# Altium project PowerBoard.PrjPCB (part 2 of 3)

## Sheet PhaseCLeg.SchDoc: Phase C
size A4; DrawnBy: Jarod Krane; Organization: Altium Limited; Address1: L3, 12a Rodborough Rd; Address2: Frenchs Forest; Address3: NSW; Address4: Australia 2086; Revision: 0; SheetNumber: 6; SheetTotal: 11
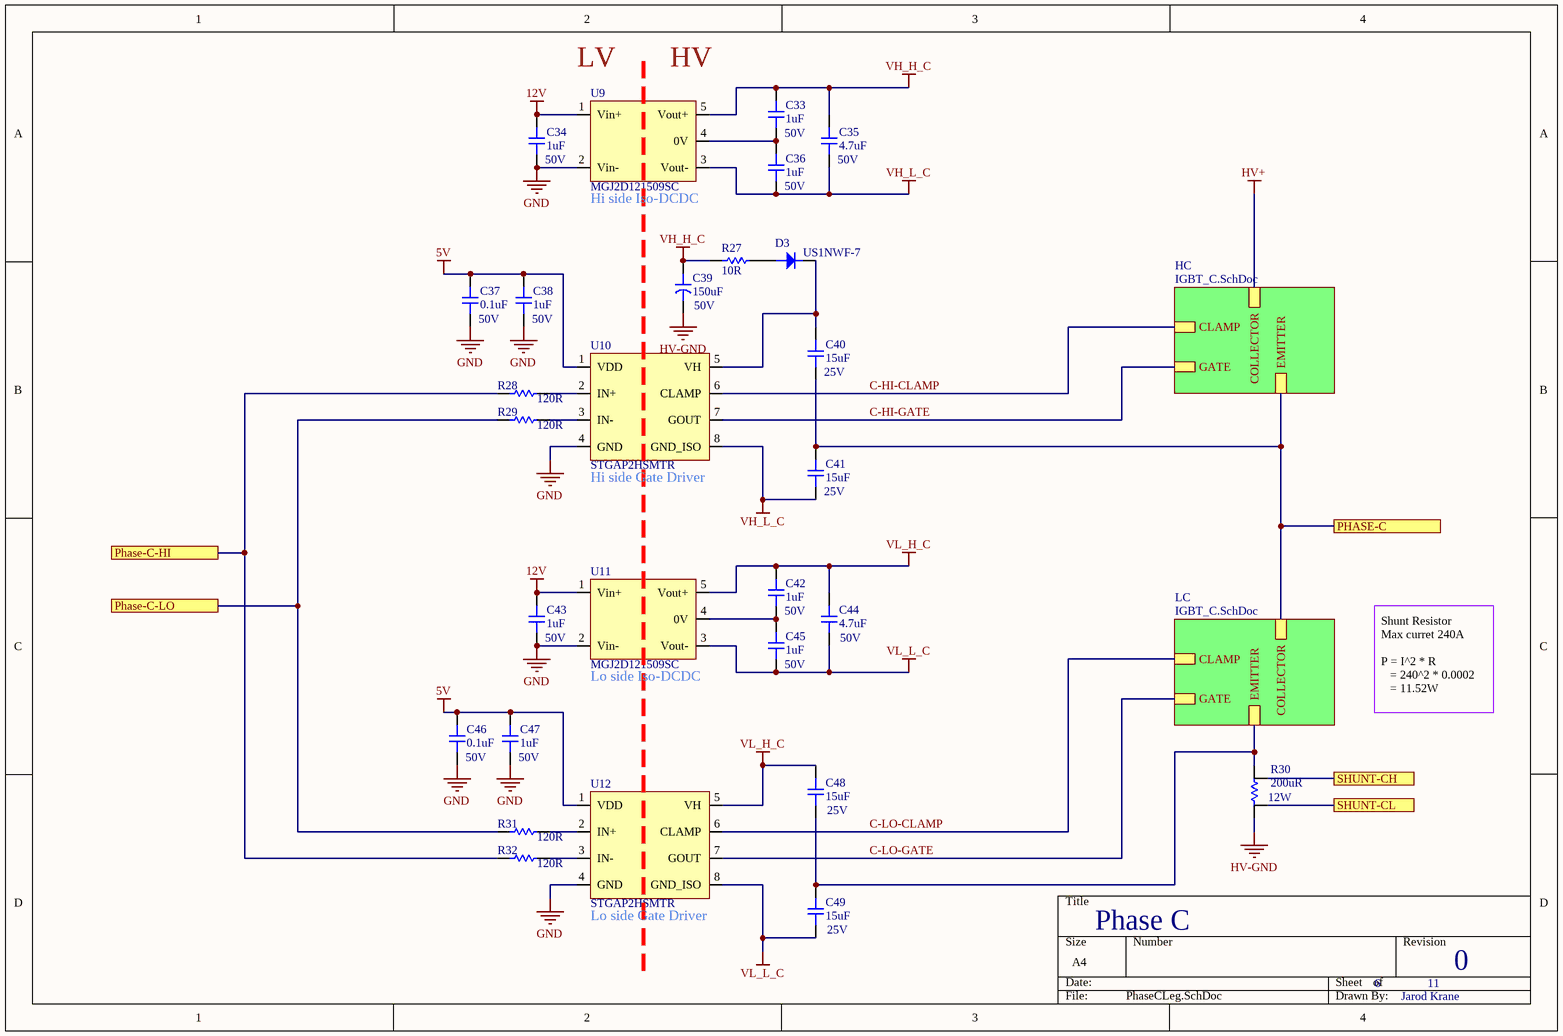
[diagram p5: PhaseCLeg.SchDoc]

### Parts
C33  1uF  Voltage Rating: 50V  [CAP-0805]
C34  1uF  Voltage Rating: 50V  [CAP-0805]
C35  4.7uF  Voltage Rating: 50V  [CAP-1206]
C36  1uF  Voltage Rating: 50V  [CAP-0805]
C37  0.1uF  Voltage: 50V  [CAP-0805]
C38  1uF  Voltage Rating: 50V  [CAP-0805]
C39  150uF  Voltage: 50V  [CAPCAN-10mm]
C40  15uF  Voltage: 25V  [CAP-1812]
C41  15uF  Voltage: 25V  [CAP-1812]
C42  1uF  Voltage Rating: 50V  [CAP-0805]
C43  1uF  Voltage Rating: 50V  [CAP-0805]
C44  4.7uF  Voltage Rating: 50V  [CAP-1206]
C45  1uF  Voltage Rating: 50V  [CAP-0805]
C46  0.1uF  Voltage: 50V  [CAP-0805]
C47  1uF  Voltage Rating: 50V  [CAP-0805]
C48  15uF  Voltage: 25V  [CAP-1812]
C49  15uF  Voltage: 25V  [CAP-1812]
D3  US1NWF-7  [DIOM2718X12N]
R27  10R  [RES-0603]
R28  120R  [RES-0603]
R29  120R  [RES-0603]
R30  200uR  Power: 12W  [RES-SHUNT]
R31  120R  [RES-0603]
R32  120R  [RES-0603]
U9  MGJ2D121509SC  [MGJ2]
U10  STGAP2HSMTR  [SO-8W]
U11  MGJ2D121509SC  [MGJ2]
U12  STGAP2HSMTR  [SO-8W]

### Sub-sheets
HC = IGBT_C.SchDoc: COLLECTOR, EMITTER, GATE, CLAMP
LC = IGBT_C.SchDoc: COLLECTOR, EMITTER, GATE, CLAMP

### Ports
PHASE-C, Phase-C-HI, Phase-C-LO, SHUNT-CH, SHUNT-CL

### Nets
5V: C37.2 C38.2 C46.2 C47.2 U10.1(VDD) U12.1(VDD)
12V: C34.2 C43.2 U9.1(Vin+) U11.1(Vin+)
GND: C34.1 C37.1 C38.1 C43.1 C46.1 C47.1 U9.2(Vin-) U10.4(GND) U11.2(Vin-) U12.4(GND)
HV-GND: C39.2 R30.1
VH_H_C: C33.2 C35.2 C39.1 R27.1 U9.5(Vout+)
VH_L_C: C35.1 C36.1 C41.1 U9.3(Vout-) U10.8(GND_ISO)
VL_H_C: C42.2 C44.2 C48.2 U11.5(Vout+) U12.5(VH)
VL_L_C: C44.1 C45.1 C49.1 U11.3(Vout-) U12.8(GND_ISO)
C-HI-CLAMP: U10.6(CLAMP) ; sheet HC/CLAMP
C-HI-GATE: U10.7(GOUT) ; sheet HC/GATE
C-HIGH: R28.1 R32.1 ; port Phase-C-HI
C-LO-CLAMP: U12.6(CLAMP) ; sheet LC/CLAMP
C-LO-GATE: U12.7(GOUT) ; sheet LC/GATE
C-LOW: R29.1 R31.1 ; port Phase-C-LO
Phase-C-OUT: C40.1 C41.2 ; port PHASE-C, sheet HC/EMITTER, sheet LC/COLLECTOR
ShuntC_N: R30.3 ; port SHUNT-CL
ShuntC_P: R30.4 ; port SHUNT-CH
NetC33_1: C33.1 C36.2 U9.4(0V)
NetC40_2: C40.2 D3.1 U10.5(VH)
NetC42_1: C42.1 C45.2 U11.4(0V)
NetC48_1: C48.1 C49.2 R30.2 ; sheet LC/EMITTER
NetD3_2: D3.2 R27.2
NetR28_2: R28.2 U10.2(IN+)
NetR29_2: R29.2 U10.3(IN-)
NetR31_2: R31.2 U12.2(IN+)
NetR32_2: R32.2 U12.3(IN-)

### Notes on the sheet
- (near U9) LV
- (near U9) HV
- (near U9) Hi side Iso-DCDC
- (near U10) Hi side Gate Driver
- (near U11) Lo side Iso-DCDC
- Shunt Resistor
  Max curret 240A
  P = I^2 * R
  = 240^2 * 0.0002
  = 11.52W
- (near U12) Lo side Gate Driver
- Title
- Size:
- Date:
- A4
- Number:
- Time:
- Revision:
- Sheet
- of
- File:

### Library data of the parts
C33 C34 C36 C38 C42 C43 C45 C47 = 0805-1uF-50V: CAP CER 1UF 50V X5R 0805; Manufacturer: KEMET; Manufacturer Part Number: C0805C105K5PACTU; Dielectric Material: Ceramic; Tolerance: 10%; Supplier 1: Digi-Key; Stock 1: 7193; Pricing 1: 1=0.33, 10=0.23, 100=0.1378, 500=0.10334, 1000=0.08726 (USD); Mount: Surface Mount; Case/Package: 0805; Weight: 0.000194oz; Case Code (Metric): 2012; Case Code (Imperial): 0805; Min Operating Temperature: -55°C; Max Operating Temperature: 85°C; Dielectric: X5R; Packaging: Tape and Reel; Termination: SMD/SMT; Voltage Rating (DC): 50V; Package Quantity: 2500; Capacitance: 1uF; Length: 0.079inch; Width: 0.049inch; Thickness: 0.055inch; REACH SVHC: No SVHC; Lead Free: Lead Free; ComponentLink1URL: https://api.kemet.com/component-edge/download/datasheet/C0805C105K5PAC7800.pdf?src-supplier=Digi-Key; ComponentLink1Description: https://api.kemet.com/component-edge/download/datasheet/C0805C105K5PAC7800.pdf?src-supplier=Digi-Key; ComponentLink2URL: http://www.farnell.com/datasheets/2746140.pdf?src-supplier=Farnell; ComponentLink2Description: http://www.farnell.com/datasheets/2746140.pdf?src-supplier=Farnell; ComponentLink3URL: http://www.mouser.com/ds/2/212/KEM_C1006_X5R_SMD-1103249.pdf?src-supplier=Mouser; ComponentLink3Description: http://www.mouser.com/ds/2/212/KEM_C1006_X5R_SMD-1103249.pdf?src-supplier=Mouser; ComponentLink4URL: http://www.farnell.com/datasheets/2746140.pdf?src-supplier=Newark; ComponentLink4Description: http://www.farnell.com/datasheets/2746140.pdf?src-supplier=Newark; ComponentLink5URL: http://www.farnell.com/datasheets/2032728.pdf?src-supplier=Element14; ComponentLink5Description: http://www.farnell.com/datasheets/2032728.pdf?src-supplier=Element14; Supplier Part Number 1: 399-15436-6-ND
C35 C44 = 1206-4.7uF-50V: CAP CER 4.7UF 50V X7R 1206; Manufacturer: TDK; Manufacturer Part Number: C3216X7R1H475K160AC; Dielectric Material: Ceramic; Tolerance: 10%; Supplier 1: Digi-Key; Stock 1: 117540; Pricing 1: 1=0.76, 10=0.535, 50=0.4042, 100=0.3521, 500=0.26082, 1000=0.2217 (USD); Mount: Surface Mount; Case/Package: 1206; Case Code (Metric): 3216; Case Code (Imperial): 1206; Weight: 0.000571oz; Min Operating Temperature: -55°C; Max Operating Temperature: 125°C; Capacitance: 4.7uF; Packaging: Tape and Reel; Voltage Rating (DC): 50V; Termination: SMD/SMT; Series: C; Package Quantity: 1; Dielectric: X7R; Resistor Type: Ceramic; Length: 3.2mm; Width: 0.063inch; Depth: 1.6mm; Thickness: 1.6mm; REACH SVHC: No SVHC; Lead Free: Lead Free; RoHS Compliant: Yes; ComponentLink1URL: https://product.tdk.com/info/en/catalog/datasheets/mlcc_commercial_general_en.pdf?src-supplier=Digi-Key; ComponentLink1Description: https://product.tdk.com/info/en/catalog/datasheets/mlcc_commercial_general_en.pdf?src-supplier=Digi-Key; ComponentLink2URL: http://www.mouser.com/ds/2/400/lcc_commercial_general_en-560200.pdf?src-supplier=Mouser; ComponentLink2Description: http://www.mouser.com/ds/2/400/lcc_commercial_general_en-560200.pdf?src-supplier=Mouser; ComponentLink3URL: http://product.tdk.com/capacitor/mlcc/en/documents/mlcc_commercial_general_en.pdf?src-supplier=Future+Electronics; ComponentLink3Description: http://product.tdk.com/capacitor/mlcc/en/documents/mlcc_commercial_general_en.pdf?src-supplier=Future+Electronics; Supplier Part Number 1: 445-8032-6-ND
C37 C46 = 0805-0.1uF-50V: CAP CER 0.1UF 50V Y5V 0805; Manufacturer: KEMET; Manufacturer Part Number: C0805C104Z5VACTU; Dielectric Material: Ceramic; Capacitance: 100nF; Tolerance: 80%; Dissipation Factor: 5%; Supplier 1: Digi-Key; Stock 1: 929243; Pricing 1: 1=0.1, 10=0.057, 100=0.0254, 500=0.01818, 1000=0.01428 (USD); Mount: Surface Mount,PCB; Case/Package: 0805; Number of Pins: 2; Case Code (Metric): 2012; Case Code (Imperial): 0805; Min Operating Temperature: -30°C; Max Operating Temperature: 85°C; Package Quantity: 1; Voltage Rating: 50V; Packaging: Tape and Reel; Voltage Rating (DC): 50V; Dielectric: Y5V; Termination: SMD/SMT; Length: 2mm; Height: 0.9mm; Lead Pitch: 0.75mm; Width: 0.049inch; Thickness: 0.039inch; Depth: 1.25mm; Radiation Hardening: No; REACH SVHC: No SVHC; Lead Free: Lead Free; ComponentLink1URL: http://www.alliedelec.com/m/d/9bfe7773041ffe9d406e68bc7b377fdd.pdf?src-supplier=Allied+Electronics; ComponentLink1Description: http://www.alliedelec.com/m/d/9bfe7773041ffe9d406e68bc7b377fdd.pdf?src-supplier=Allied+Electronics; ComponentLink2URL: https://www.verical.com/server-webapp/html/getDatasheet?partID=37101&src-supplier=Verical; ComponentLink2Description: https://www.verical.com/server-webapp/html/getDatasheet?partID=37101&src-supplier=Verical; ComponentLink3URL: https://www.verical.com/server-webapp/html/getDatasheet?partID=321176&src-supplier=Verical; ComponentLink3Description: https://www.verical.com/server-webapp/html/getDatasheet?partID=321176&src-supplier=Verical; ComponentLink4URL: http://www.farnell.com/datasheets/2123124.pdf?src-supplier=Element14; ComponentLink4Description: http://www.farnell.com/datasheets/2123124.pdf?src-supplier=Element14; Supplier Part Number 1: 399-1177-6-ND
C39 = 10mm-150uF-50V: CAP POLYMER HYBRID 150UF 50V SMD; Manufacturer: Panasonic; Manufacturer Part Number: EEHZS1H151P; Supplier 1: Digi-Key; Stock 1: 1212; Pricing 1: 1=2.07, 10=1.673, 50=1.46, 100=1.2775 (USD); Supplier Part Number 1: 10-EEH-ZS1H151PDKR-ND
C40 C41 C48 C49 = 1812-15uF-25V: CAP CER 15UF 25V X7R 1812; Manufacturer: TDK; Manufacturer Part Number: C4532X7R1E156M280KB; Dielectric Material: Ceramic; Tolerance: 20%; Supplier 1: Digi-Key; Stock 1: 9166; Pricing 1: 1=1.18, 10=0.932, 50=0.8072, 100=0.6986 (USD); Mount: Surface Mount; Case/Package: 1812; Number of Pins: 2; Case Code (Imperial): 1812; Case Code (Metric): 4532; Weight: 0.000952oz; Min Operating Temperature: -55°C; Max Operating Temperature: 125°C; Voltage Rating: 25V; Capacitance: 15uF; Voltage Rating (DC): 25V; Packaging: Tape and Reel; Dielectric: X7R; Termination: SMD/SMT; Package Quantity: 1; Resistor Type: Ceramic; Series: C; Length: 4.5mm; Width: 0.126inch; Height: 2.8mm; Depth: 3.2mm; Thickness: 0.122inch; RoHS Compliant: Yes; Lead Free: Lead Free; REACH SVHC: No SVHC; ComponentLink1URL: http://www.farnell.com/datasheets/1913358.pdf?src-supplier=Element14; ComponentLink1Description: http://www.farnell.com/datasheets/1913358.pdf?src-supplier=Element14; ComponentLink2URL: https://product.tdk.com/info/en/documents/chara_sheet/C4532X7R1E156M280KB.pdf?src-supplier=Digi-Key; ComponentLink2Description: https://product.tdk.com/info/en/documents/chara_sheet/C4532X7R1E156M280KB.pdf?src-supplier=Digi-Key; ComponentLink3URL: https://product.tdk.com/en/products/common/pdf/mlcc_partnumber_description.pdf?src-supplier=Digi-Key; ComponentLink3Description: https://product.tdk.com/en/products/common/pdf/mlcc_partnumber_description.pdf?src-supplier=Digi-Key; ComponentLink4URL: http://uk.rs-online.com/webdocs/1532/0900766b81532cd0.pdf?src-supplier=RSComponents; ComponentLink4Description: http://uk.rs-online.com/webdocs/1532/0900766b81532cd0.pdf?src-supplier=RSComponents; ComponentLink5URL: http://www.tdk.com/pdf/general_B11.pdf?src-supplier=Future+Electronics; ComponentLink5Description: http://www.tdk.com/pdf/general_B11.pdf?src-supplier=Future+Electronics; Supplier Part Number 1: 445-3921-6-ND
D3 = Diode 1.2KV-1A: DIODE GEN PURP 1.2KV 1A SOD123F; Manufacturer: Diodes; Reverse Recovery Time: 80ns; Supplier 1: Digi-Key; Manufacturer Part Number: US1NWF-7; Stock 1: 33557; Pricing 1: 1=0.54, 10=0.438, 100=0.2985, 500=0.22388, 1000=0.1679 (USD); Mount: Surface Mount; Packaging: Tape and Reel; Max Reverse Voltage (DC): 1.2kV; Average Rectified Current: 1A; ComponentLink1URL: https://www.diodes.com/assets/Datasheets/US1NWF.pdf?src-supplier=Digi-Key; ComponentLink1Description: https://www.diodes.com/assets/Datasheets/US1NWF.pdf?src-supplier=Digi-Key; Supplier Part Number 1: US1NWF-7DIDKR-ND
R27 = 0603-10R: RES SMD 10 OHM 1% 1/10W 0603; Manufacturer: Yageo; Manufacturer Part Number: RC0603FR-0710RL; Voltage Rating (DC): 50V; Temperature Coefficient: 200ppm/°C; Power Rating: 100mW; Supplier 1: Digi-Key; Stock 1: 11151092; Pricing 1: 1=0.1, 10=0.046, 100=0.0187, 1000=0.0084, 2500=0.00729 (USD); Case/Package: 0603; Number of Pins: 2; Case Code (Imperial): 0603; Case Code (Metric): 1608; Contact Plating: Tin,Matte; Min Operating Temperature: -55°C; Max Operating Temperature: 155°C; Packaging: Tape and Reel; Resistance: 10R; Tolerance: 1%; Composition: Thick Film; Voltage Rating: 50V; Termination: SMD/SMT; Military Standard: Not; Length: 1.6mm; Height: 0.45mm; Width: 0.8mm; Depth: 0.8mm; Radiation Hardening: No; REACH SVHC: No SVHC; Lead Free: Lead Free; ComponentLink1URL: http://www.farnell.com/datasheets/1868787.pdf?src-supplier=Element14; ComponentLink1Description: http://www.farnell.com/datasheets/1868787.pdf?src-supplier=Element14; ComponentLink2URL: http://www.yageo.com/documents/recent/PYu-RC0603_51_RoHS_L_4.pdf?src-supplier=Avnet; ComponentLink2Description: http://www.yageo.com/documents/recent/PYu-RC0603_51_RoHS_L_4.pdf?src-supplier=Avnet; ComponentLink3URL: http://documents.rs-components.com/techlib://itc_doclist_GB.htm?stockno=5048984&src-supplier=RSComponents; ComponentLink3Description: http://documents.rs-components.com/techlib://itc_doclist_GB.htm?stockno=5048984&src-supplier=RSComponents; ComponentLink4URL: http://www.yageo.com/documents/recent/PYu-RC0603_51_RoHS_L_4.pdf?src-supplier=Avnet+Europe; ComponentLink4Description: http://www.yageo.com/documents/recent/PYu-RC0603_51_RoHS_L_4.pdf?src-supplier=Avnet+Europe; Supplier Part Number 1: 311-10.0HRDKR-ND
R28 R29 R31 R32 = 0603-120R: RES SMD 120 OHM 1% 1/10W 0603; Manufacturer: Yageo; Manufacturer Part Number: RC0603FR-07120RL; Voltage Rating (DC): 50V; Temperature Coefficient: 100ppm/°C; Power Rating: 100mW; Supplier 1: Digi-Key; Stock 1: 1047274; Pricing 1: 1=0.1, 10=0.023, 100=0.0094, 1000=0.00421, 2500=0.00366 (USD); Case/Package: 0603; Number of Pins: 2; Case Code (Metric): 1608; Case Code (Imperial): 0603; Min Operating Temperature: -55°C; Max Operating Temperature: 155°C; Resistance: 120R; Tolerance: 1%; Packaging: Tape and Reel; Composition: Thick Film; Voltage Rating: 50V; Package Quantity: 1; Number of Terminations: 2; Termination: SMD/SMT; Military Standard: Not; Max Power Dissipation: 100mW; Features: Moisture Resistant; Length: 1.6mm; Height: 0.022inch; Width: 0.031inch; Depth: 0.8mm; REACH SVHC: No SVHC; Lead Free: Lead Free; ComponentLink1URL: http://www.yageo.com/documents/recent/PYu-RC_Group_51_RoHS_L_10.pdf?src-supplier=Digi-Key; ComponentLink1Description: http://www.yageo.com/documents/recent/PYu-RC_Group_51_RoHS_L_10.pdf?src-supplier=Digi-Key; ComponentLink2URL: http://www.farnell.com/datasheets/2167052.pdf?src-supplier=Element14; ComponentLink2Description: http://www.farnell.com/datasheets/2167052.pdf?src-supplier=Element14; ComponentLink3URL: http://www.farnell.com/datasheets/1868787.pdf?src-supplier=Element14; ComponentLink3Description: http://www.farnell.com/datasheets/1868787.pdf?src-supplier=Element14; ComponentLink4URL: http://www.farnell.com/datasheets/443971.pdf?src-supplier=Element14; ComponentLink4Description: http://www.farnell.com/datasheets/443971.pdf?src-supplier=Element14; Supplier Part Number 1: 311-120HRDKR-ND
R30 = 3920-200uR-SHUNT: RES SMD 200 UOHM 1% 12W 3920; Manufacturer: Bourns; Manufacturer Part Number: CSS2H-3920R-L200FE; Supplier 1: Digi-Key; Stock 1: 420; Pricing 1: 1=1.6, 10=1.42, 25=1.3052, 50=1.1908, 100=1.0305, 250=0.8702, 500=0.7328 (USD); RoHS Compliant: Yes; ComponentLink1URL: https://www.bourns.com/docs/Product-Datasheets/css2h-3920.pdf?src-supplier=Digi-Key; ComponentLink1Description: https://www.bourns.com/docs/Product-Datasheets/css2h-3920.pdf?src-supplier=Digi-Key; Supplier Part Number 1: CSS2H-3920R-L200FEDKR-ND
U9 U11 = 15V/-8.7V: Isolated Module DC DC Converter Output 15V -8.7V - 80mA, 40mA 10.8V - 13.2V Input; Manufacturer: Murata; Number of Outputs: 2; Output Power: 2W; Isolation Voltage: 5.2kV; Efficiency: 80%; Nominal Input Voltage: 12V; Supplier 1: Digi-Key; Manufacturer Part Number: MGJ2D121509SC; Stock 1: 371; Pricing 1: 1=8.46, 5=8.42, 10=8.36, 25=8.27, 50=8.06, 100=7.66, 250=7.17, 500=6.68, 1000=6.65 (USD); Mount: Through Hole; Case/Package: SIP; Number of Pins: 5; Weight: 0.151678oz; Min Operating Temperature: -40°C; Max Operating Temperature: 100°C; Max Input Voltage: 13.2V; Min Input Voltage: 10.8V; Packaging: Rail/Tube; Max Input Voltage (DC): 13.2V; Min Input Voltage (DC): 10.8V; Voltage - Output 1: 15V; Voltage - Output 2: -8.7V; Max Output Current: 40mA; Current - Output 1: 80mA; Current - Output 2: 40mA; Max Output Power: 2W; Output Voltage: 15V; Output Current: 80mA; Max Power Dissipation: 2W; Package Quantity: 25; Features: SCP; Length: 0.77inch; Width: 0.39inch; Height: 0.5inch; Depth: 12.65mm; Radiation Hardening: No; REACH SVHC: No SVHC; RoHS Compliant: Yes; ComponentLink1URL: http://www.farnell.com/datasheets/1965123.pdf?src-supplier=Element14; ComponentLink1Description: http://www.farnell.com/datasheets/1965123.pdf?src-supplier=Element14; ComponentLink2URL: http://power.murata.com/data/power/ncl/kdc_mgj2.pdf?src-supplier=Avnet; ComponentLink2Description: http://power.murata.com/data/power/ncl/kdc_mgj2.pdf?src-supplier=Avnet; Supplier Part Number 1: 811-3002-5-ND
U10 U12 = STGAP2HSMTR: GALVANICALLY ISOLATED 4 A SINGLE GATE DRIVER; Manufacturer: Samtec; Manufacturer Part Number: ERF8-010-07.0-L-DV-L-K-TR; Supplier 1: Digi-Key; Stock 1: 498; Pricing 1: 1=3.01, 10=2.699, 25=2.5516, 100=2.2113, 250=2.09788, 500=1.88242 (USD); Supplier Part Number 1: 497-STGAP2HSMDKR-ND

## Sheet IGBT_C.SchDoc: IGBT C
size A4; DrawnBy: Jarod Krane; Organization: Altium Limited; Address1: L3, 12a Rodborough Rd; Address2: Frenchs Forest; Address3: NSW; Address4: Australia 2086; Revision: 0; SheetNumber: 7; SheetTotal: 11
Used 2 times, as channels U_PhaseCLeg/HC, U_PhaseCLeg/LC. Parts and nets are listed once, with the designators drawn on the sheet.
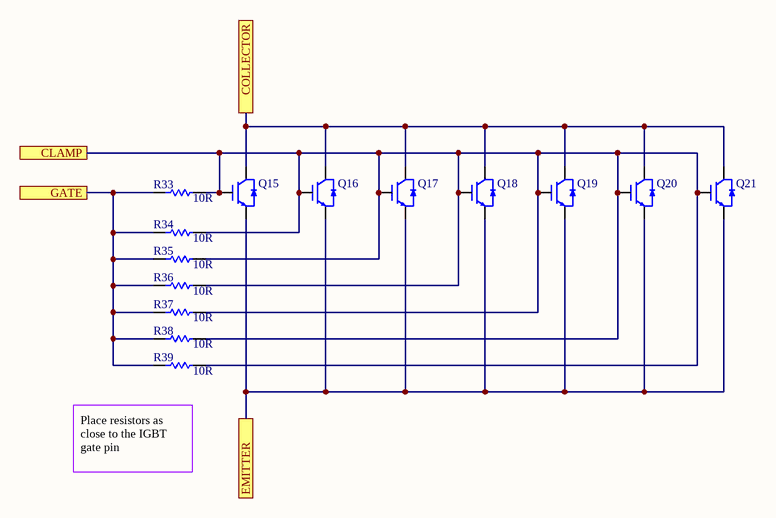
[diagram p6: IGBT_C.SchDoc]

### Parts
Q15  STGB30V60DF  [DPAK2_IGBT]  (value not drawn)
Q16  STGB30V60DF  [DPAK2_IGBT]  (value not drawn)
Q17  STGB30V60DF  [DPAK2_IGBT]  (value not drawn)
Q18  STGB30V60DF  [DPAK2_IGBT]  (value not drawn)
Q19  STGB30V60DF  [DPAK2_IGBT]  (value not drawn)
Q20  STGB30V60DF  [DPAK2_IGBT]  (value not drawn)
Q21  STGB30V60DF  [DPAK2_IGBT]  (value not drawn)
R33  10R  [RES-0603]
R34  10R  [RES-0603]
R35  10R  [RES-0603]
R36  10R  [RES-0603]
R37  10R  [RES-0603]
R38  10R  [RES-0603]
R39  10R  [RES-0603]

### Ports
CLAMP, COLLECTOR, EMITTER, GATE

### Nets
CLAMP: Q15.1 Q16.1 Q17.1 Q18.1 Q19.1 Q20.1 Q21.1 R33.2 R34.2 R35.2 R36.2 R37.2 R38.2 R39.2 ; port CLAMP
COLLECTOR: Q15.2 Q16.2 Q17.2 Q18.2 Q19.2 Q20.2 Q21.2 ; port COLLECTOR
EMITTER: Q15.3 Q16.3 Q17.3 Q18.3 Q19.3 Q20.3 Q21.3 ; port EMITTER
GATE: R33.1 R34.1 R35.1 R36.1 R37.1 R38.1 R39.1 ; port GATE

### Channels
U_PhaseCLeg/HC: designators end in _HC; ports CLAMP=C-HI-CLAMP COLLECTOR=HV+ EMITTER=Phase-C-OUT GATE=C-HI-GATE
U_PhaseCLeg/LC: designators end in _LC; ports CLAMP=C-LO-CLAMP COLLECTOR=Phase-C-OUT EMITTER=NetC48_1 GATE=C-LO-GATE

### Notes on the sheet
- (near R39) Place resistors as close to the IGBT gate pin
- Title
- Size:
- Date:
- A4
- Number:
- Time:
- Revision:
- Sheet
- of
- File:

### Library data of the parts
Q15-Q21 = STGB30V60DF: IGBT 600V 60A 258W D2PAK; Manufacturer: STMicroelectronics; Reverse Recovery Time: 53ns; Element Configuration: Single; Collector Emitter Saturation Voltage: 1.85V; Supplier 1: Digi-Key; Manufacturer Part Number: STGB30V60DF; Stock 1: 916; Pricing 1: 1=2.43, 10=2.015, 25=1.9496, 100=1.604, 500=1.358 (USD); Mount: Surface Mount; Case/Package: TO-263-3; Weight: 0.079014oz; Min Operating Temperature: -55°C; Max Operating Temperature: 175°C; Packaging: Tape and Reel; Collector Emitter Voltage (VCEO): 600V; Max Collector Current: 60A; Max Power Dissipation: 258W; Collector Emitter Breakdown Voltage: 600V; Max Breakdown Voltage: 600V; Package Quantity: 1000; RoHS Compliant: Yes; ComponentLink1URL: http://www.st.com/content/ccc/resource/technical/document/datasheet/14/ad/1c/bd/db/a9/4a/fc/DM00079435.pdf/files/DM00079435.pdf/jcr:content/translations/en.DM00079435.pdf?src-supplier=Digi-Key; ComponentLink1Description: http://www.st.com/content/ccc/resource/technical/document/datasheet/14/ad/1c/bd/db/a9/4a/fc/DM00079435.pdf/files/DM00079435.pdf/jcr:content/translations/en.DM00079435.pdf?src-supplier=Digi-Key; ComponentLink2URL: http://www.mouser.com/ds/2/389/stgb30v60df-956007.pdf?src-supplier=Mouser; ComponentLink2Description: http://www.mouser.com/ds/2/389/stgb30v60df-956007.pdf?src-supplier=Mouser; ComponentLink3URL: http://www.st.com/st-web-ui/static/active/en/resource/technical/document/datasheet/DM00079435.pdf?src-supplier=Avnet; ComponentLink3Description: http://www.st.com/st-web-ui/static/active/en/resource/technical/document/datasheet/DM00079435.pdf?src-supplier=Avnet; ComponentLink4URL: http://components.arrow.com/part/dataview/0323_06933392?src-supplier=Arrow+Europe; ComponentLink4Description: http://components.arrow.com/part/dataview/0323_06933392?src-supplier=Arrow+Europe; Supplier Part Number 1: 497-15120-6-ND
R33-R39 = 0603-10R: as R27 on sheet PhaseCLeg; Supplier 1: Digi-Key; Stock 1: 11151092; Pricing 1: 1=0.1, 10=0.046, 100=0.0187, 1000=0.0084, 2500=0.00729 (USD); Case/Package: 0603; Number of Pins: 2; Case Code (Imperial): 0603; Case Code (Metric): 1608; Contact Plating: Tin,Matte; Min Operating Temperature: -55°C; Max Operating Temperature: 155°C; Packaging: Tape and Reel; Resistance: 10R; Tolerance: 1%; Composition: Thick Film; Voltage Rating: 50V; Termination: SMD/SMT; Military Standard: Not; Length: 1.6mm; Height: 0.45mm; Width: 0.8mm; Depth: 0.8mm; Radiation Hardening: No; REACH SVHC: No SVHC; Lead Free: Lead Free; ComponentLink1URL: http://www.farnell.com/datasheets/1868787.pdf?src-supplier=Element14; ComponentLink1Description: http://www.farnell.com/datasheets/1868787.pdf?src-supplier=Element14; ComponentLink2URL: http://www.yageo.com/documents/recent/PYu-RC0603_51_RoHS_L_4.pdf?src-supplier=Avnet; ComponentLink2Description: http://www.yageo.com/documents/recent/PYu-RC0603_51_RoHS_L_4.pdf?src-supplier=Avnet; ComponentLink3URL: http://documents.rs-components.com/techlib://itc_doclist_GB.htm?stockno=5048984&src-supplier=RSComponents; ComponentLink3Description: http://documents.rs-components.com/techlib://itc_doclist_GB.htm?stockno=5048984&src-supplier=RSComponents; ComponentLink4URL: http://www.yageo.com/documents/recent/PYu-RC0603_51_RoHS_L_4.pdf?src-supplier=Avnet+Europe; ComponentLink4Description: http://www.yageo.com/documents/recent/PYu-RC0603_51_RoHS_L_4.pdf?src-supplier=Avnet+Europe; Supplier Part Number 1: 311-10.0HRDKR-ND

## Sheet Sensors.SchDoc: Sensors
size A4; DrawnBy: Jarod Krane; Organization: Altium Limited; Address1: L3, 12a Rodborough Rd; Address2: Frenchs Forest; Address3: NSW; Address4: Australia 2086; Revision: 0; SheetNumber: 10; SheetTotal: 11
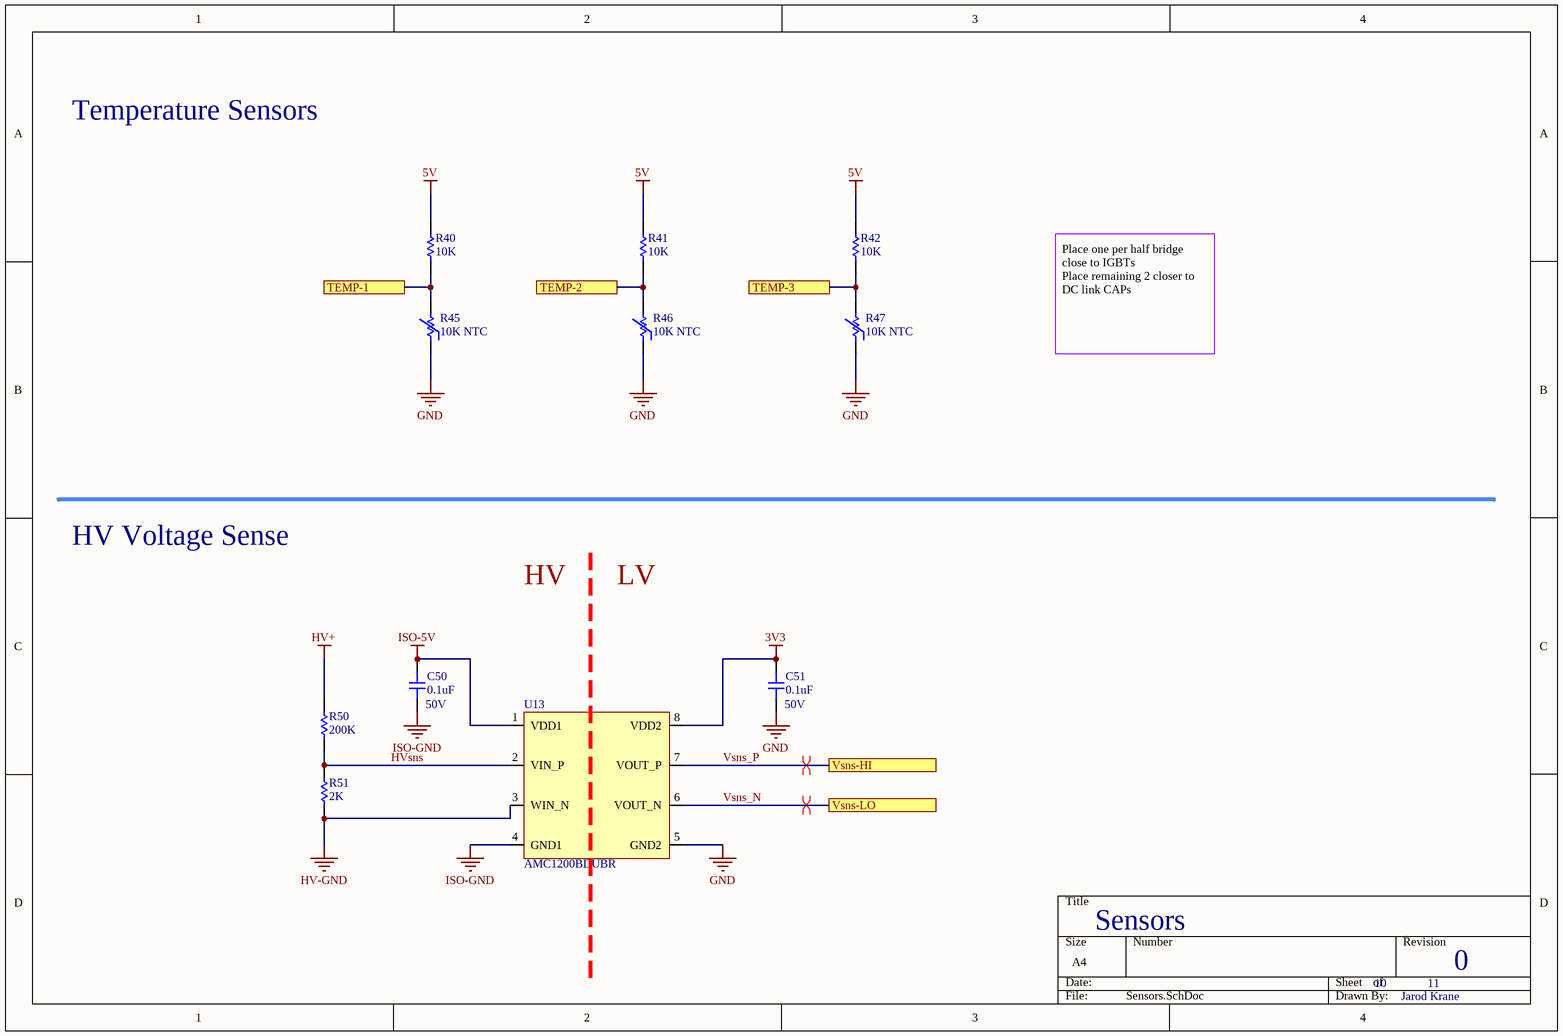
[diagram p7: Sensors.SchDoc]

### Parts
C50  0.1uF  Voltage Rating (DC): 50V  [CAP-0805]
C51  0.1uF  Voltage: 50V  [CAP-0805]
R40  10K  [RES-0603]
R41  10K  [RES-0603]
R42  10K  [RES-0603]
R45  10K NTC  [RES-0603]
R46  10K NTC  [RES-0603]
R47  10K NTC  [RES-0603]
R50  200K  [RES-0603]
R51  2K  [RES-0603]
U13  AMC1200BDUBR  [8-SOP]

### Ports
TEMP-1, TEMP-2, TEMP-3, Vsns-HI, Vsns-LO

### Nets
3V3: C51.2 U13.8(VDD2)
5V: R40.2 R41.2 R42.2
GND: C51.1 R45.1 R46.1 R47.1 U13.5(GND2)
HV+: R50.2
HV-GND: R51.1 U13.3(WIN_N)
ISO-5V: C50.2 U13.1(VDD1)
ISO-GND: C50.1 U13.4(GND1)
HVsns: R50.1 R51.2 U13.2(VIN_P)
TEMP1: R40.1 R45.2 ; port TEMP-1
TEMP2: R41.1 R46.2 ; port TEMP-2
TEMP3: R42.1 R47.2 ; port TEMP-3
Vsns_N: U13.6(VOUT_N) ; port Vsns-LO
Vsns_P: U13.7(VOUT_P) ; port Vsns-HI

### Layout directives
differential pair: Vsns_N, Vsns_P

### Notes on the sheet
- Temperature Sensors
- Place one per half bridge close to IGBTs
  Place remaining 2 closer to DC link CAPs
- HV Voltage Sense
- HV
- LV
- Title
- Size:
- Date:
- A4
- Number:
- Time:
- Revision:
- Sheet
- of
- File:

### Library data of the parts
C50 C51 = 0805-0.1uF-50V: as C37 on sheet PhaseCLeg; Supplier 1: Digi-Key; Stock 1: 929243; Pricing 1: 1=0.1, 10=0.057, 100=0.0254, 500=0.01818, 1000=0.01428 (USD); Mount: Surface Mount,PCB; Case/Package: 0805; Number of Pins: 2; Case Code (Metric): 2012; Case Code (Imperial): 0805; Min Operating Temperature: -30°C; Max Operating Temperature: 85°C; Package Quantity: 1; Voltage Rating: 50V; Packaging: Tape and Reel; Dielectric: Y5V; Termination: SMD/SMT; Length: 2mm; Height: 0.9mm; Lead Pitch: 0.75mm; Width: 0.049inch; Thickness: 0.039inch; Depth: 1.25mm; Radiation Hardening: No; REACH SVHC: No SVHC; Lead Free: Lead Free; ComponentLink1URL: http://www.alliedelec.com/m/d/9bfe7773041ffe9d406e68bc7b377fdd.pdf?src-supplier=Allied+Electronics; ComponentLink1Description: http://www.alliedelec.com/m/d/9bfe7773041ffe9d406e68bc7b377fdd.pdf?src-supplier=Allied+Electronics; ComponentLink2URL: https://www.verical.com/server-webapp/html/getDatasheet?partID=37101&src-supplier=Verical; ComponentLink2Description: https://www.verical.com/server-webapp/html/getDatasheet?partID=37101&src-supplier=Verical; ComponentLink3URL: https://www.verical.com/server-webapp/html/getDatasheet?partID=321176&src-supplier=Verical; ComponentLink3Description: https://www.verical.com/server-webapp/html/getDatasheet?partID=321176&src-supplier=Verical; ComponentLink4URL: http://www.farnell.com/datasheets/2123124.pdf?src-supplier=Element14; ComponentLink4Description: http://www.farnell.com/datasheets/2123124.pdf?src-supplier=Element14; Supplier Part Number 1: 399-1177-6-ND
  C50: Voltage: 50V
  C51: Voltage Rating (DC): 50V
R40-R42 = 0603-10KR: RES SMD 10K OHM 5% 1/10W 0603; Manufacturer: Yageo; Manufacturer Part Number: RC0603JR-0710KL; Resistance: 10kR; Voltage Rating (DC): 50V; Temperature Coefficient: 100ppm/°C; Power Rating: 100mW; Supplier 1: Digi-Key; Stock 1: 3006558; Pricing 1: 1=0.1, 10=0.019, 100=0.0077, 1000=0.00347, 2500=0.00301 (USD); Case/Package: 0603; Number of Pins: 2; Contact Plating: Tin,Matte; Case Code (Imperial): 0603; Case Code (Metric): 1608; Min Operating Temperature: -55°C; Max Operating Temperature: 155°C; Packaging: Tape and Reel; Tolerance: 5%; Composition: Thick Film; Voltage Rating: 50V; Termination: SMD/SMT; Military Standard: Not; Features: Moisture Resistant; Max Power Dissipation: 100mW; Number of Terminations: 2; Length: 0.063inch; Width: 0.031inch; Depth: 0.8mm; Height - Seated (Max): 0.022inch; Radiation Hardening: No; REACH SVHC: Unknown; Lead Free: Lead Free; ComponentLink1URL: http://www.yageo.com/documents/recent/PYu-RC_Group_51_RoHS_L_10.pdf?src-supplier=Digi-Key; ComponentLink1Description: http://www.yageo.com/documents/recent/PYu-RC_Group_51_RoHS_L_10.pdf?src-supplier=Digi-Key; Supplier Part Number 1: 311-10KGRDKR-ND
R45-R47 = 0603-10K-thermistor: THERMISTOR NTC 10KOHM 3380K 0603; Manufacturer: Murata; Manufacturer Part Number: NCP18XH103F03RB; Resistance: 10kR; Tolerance: 1%; Power Rating: 100mW; Current Rating: 310uA; Accuracy: 0.7%; Supplier 1: Digi-Key; Stock 1: 66922; Pricing 1: 1=0.24, 5=0.23, 10=0.204, 25=0.1876, 50=0.15, 100=0.1286, 500=0.1125, 1000=0.09643 (USD); Mount: Surface Mount; Case/Package: 0603; Number of Pins: 2; Case Code (Metric): 1608; Case Code (Imperial): 0603; Number of Terminals: 2; Min Operating Temperature: -40°C; Max Operating Temperature: 125°C; Packaging: Tape and Reel; Package Quantity: 1; Termination: SMD/SMT; Max Power Dissipation: 100mW; Length: 1.6mm; Height: 0.8mm; Depth: 0.8mm; Radiation Hardening: No; REACH SVHC: No SVHC; Lead Free: Lead Free; ComponentLink1URL: http://www.mouser.com/ds/2/281/r44e-522712.pdf?src-supplier=Mouser; ComponentLink1Description: http://www.mouser.com/ds/2/281/r44e-522712.pdf?src-supplier=Mouser; ComponentLink2URL: http://uk.rs-online.com/webdocs/07f1/0900766b807f1e39.pdf?src-supplier=RSComponents; ComponentLink2Description: http://uk.rs-online.com/webdocs/07f1/0900766b807f1e39.pdf?src-supplier=RSComponents; ComponentLink3URL: http://www.murata.com/~/media/webrenewal/support/library/catalog/products/thermistor/ntc/r44e.ashx?src-supplier=Avnet; ComponentLink3Description: http://www.murata.com/~/media/webrenewal/support/library/catalog/products/thermistor/ntc/r44e.ashx?src-supplier=Avnet; ComponentLink4URL: https://www.verical.com/server-webapp/html/getDatasheet?partID=153236&src-supplier=Verical; ComponentLink4Description: https://www.verical.com/server-webapp/html/getDatasheet?partID=153236&src-supplier=Verical; ComponentLink5URL: https://www.murata.com/~/media/webrenewal/support/library/catalog/products/thermistor/ntc/r44e.ashx?la=en-us&src-supplier=Digi-Key; ComponentLink5Description: https://www.murata.com/~/media/webrenewal/support/library/catalog/products/thermistor/ntc/r44e.ashx?la=en-us&src-supplier=Digi-Key; ComponentLink6URL: http://search.murata.co.jp/Ceramy/image/img/w_hinm/L0770E.pdf?src-supplier=Future+Electronics; ComponentLink6Description: http://search.murata.co.jp/Ceramy/image/img/w_hinm/L0770E.pdf?src-supplier=Future+Electronics; ComponentLink7URL: http://search.murata.co.jp/Ceramy/image/img/w_hinm/L0770E.pdf?src-supplier=Avnet+Europe; ComponentLink7Description: http://search.murata.co.jp/Ceramy/image/img/w_hinm/L0770E.pdf?src-supplier=Avnet+Europe; Supplier Part Number 1: 490-4800-6-ND
R50 = 0603-200KR: RES SMD 200K OHM 1% 1/10W 0603; Manufacturer: Yageo; Manufacturer Part Number: AF0603FR-07200KL; Max Power Dissipation: 100mW; Temperature Coefficient: 100ppm/°C; Resistance: 200kR; Supplier 1: Digi-Key; Stock 1: 4721; Pricing 1: 1=0.1, 10=0.061, 100=0.0247, 1000=0.01109, 2500=0.00963 (USD); Case/Package: 0603; Min Operating Temperature: -55°C; Max Operating Temperature: 155°C; Packaging: Tape and Reel; Resistor Type: Thick Film; Number of Terminations: 2; Tolerance: 1%; Features: Moisture Resistant,Anti-Sulfur; Length: 0.063inch; Width: 0.031inch; Height: 0.022inch; RoHS Compliant: Yes; ComponentLink1URL: http://www.yageo.com/documents/recent/PYu-AF_51_RoHS_L_5.pdf?src-supplier=Digi-Key; ComponentLink1Description: http://www.yageo.com/documents/recent/PYu-AF_51_RoHS_L_5.pdf?src-supplier=Digi-Key; Supplier Part Number 1: 13-AF0603FR-07200KLDKR-ND
R51 = 0603-2KR: RES SMD 2K OHM 1% 1/4W 0603; Manufacturer: Vishay Dale; Manufacturer Part Number: CRCW06032K00FKEAHP; Resistance: 2kR; Power Rating: 250mW; Voltage Rating: 75V; Temperature Coefficient: 100ppm/°C; Supplier 1: Digi-Key; Stock 1: 23723; Pricing 1: 1=0.17, 10=0.142, 100=0.0553, 1000=0.02317, 2500=0.02124 (USD); Mount: Surface Mount; Case/Package: 0603; Weight: 7.1E-05oz; Case Code (Metric): 1608; Case Code (Imperial): 0603; Contact Plating: Tin; Min Operating Temperature: -55°C; Max Operating Temperature: 155°C; Package Quantity: 10; Tolerance: 1%; Packaging: Tape and Reel; Composition: Thick Film; Number of Terminations: 2; Termination: Solder; Max Power Dissipation: 250mW; Features: Automotive AEC-Q200; Military Standard: Not; Length: 1.6mm; Height: 0.45mm; Width: 0.033inch; Depth: 0.85mm; Radiation Hardening: No; Lead Free: Lead Free; ComponentLink1URL: http://www.vishay.com/docs/20043/crcwhpe3.pdf?src-supplier=Digi-Key; ComponentLink1Description: http://www.vishay.com/docs/20043/crcwhpe3.pdf?src-supplier=Digi-Key; Supplier Part Number 1: 541-2.00KSDKR-ND
U13 = ISO-OPAMP: IC OPAMP ISOLATION 1 CIRC 8SOP; Manufacturer: Texas Instruments; Number of Channels: 1; Common Mode Rejection Ratio: 95dB; Operating Supply Voltage: 5.5V; -3db Bandwidth: 100kHz; Nominal Supply Current: 5.4mA; Output Current: 20mA; Max Input Voltage: 320mV; Input Offset Voltage (Vos): 200uV; Power Dissipation: 44mW; Power Supply Rejection Ratio (PSRR): 61dB; Dual Supply Voltage: 5V; Power Consumption: 82.5mW; Supplier 1: Digi-Key; Manufacturer Part Number: AMC1200BDUBR; Stock 1: 0; Pricing 1: 1=4.92, 10=4.415, 25=4.1736, 100=3.6172 (USD); Mount: Surface Mount; Case/Package: SOP; Number of Pins: 8; Min Operating Temperature: -40°C; Max Operating Temperature: 105°C; Max Dual Supply Voltage: 5.5V; Packaging: Tape and Reel; Package Quantity: 350; Bandwidth: 100kHz; Number of Circuits: 1; Operating Supply Current: 5.4mA; Output Current per Channel: 20mA; Max Power Dissipation: 44mW; Number of Elements: 1; Series: -; Amplifier Type: ISOLATION; Supply Current: 5.4mA; Lead Free: Lead Free; RoHS Compliant: Yes; ComponentLink1URL: http://www.ti.com/general/docs/lit/getliterature.tsp?genericPartNumber=AMC1200&&fileType=pdf&src-supplier=Avnet; ComponentLink1Description: http://www.ti.com/general/docs/lit/getliterature.tsp?genericPartNumber=AMC1200&&fileType=pdf&src-supplier=Avnet; ComponentLink2URL: http://www.ti.com/lit/ds/symlink/amc1200.pdf?src-supplier=Digi-Key; ComponentLink2Description: http://www.ti.com/lit/ds/symlink/amc1200.pdf?src-supplier=Digi-Key; Supplier Part Number 1: 296-38868-6-ND

## Sheet AIRControl.SchDoc: AIR Control
size A4; DrawnBy: Jarod Krane; Organization: Altium Limited; Address1: L3, 12a Rodborough Rd; Address2: Frenchs Forest; Address3: NSW; Address4: Australia 2086; Revision: 0; SheetNumber: 11; SheetTotal: 11
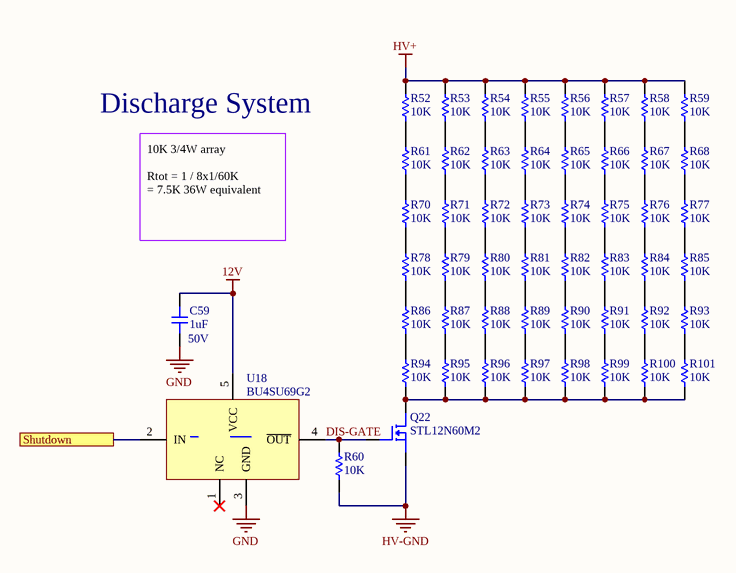
[diagram p8: AIRControl.SchDoc]

### Parts
C59  1uF  Voltage Rating: 50V  [CAP-0805]
Q22  STL12N60M2  [POWERFLAT-FET]
R52  10K  [RES-1206]
R53  10K  [RES-1206]
R54  10K  [RES-1206]
R55  10K  [RES-1206]
R56  10K  [RES-1206]
R57  10K  [RES-1206]
R58  10K  [RES-1206]
R59  10K  [RES-1206]
R60  10K  [RES-0603]
R61  10K  [RES-1206]
R62  10K  [RES-1206]
R63  10K  [RES-1206]
R64  10K  [RES-1206]
R65  10K  [RES-1206]
R66  10K  [RES-1206]
R67  10K  [RES-1206]
R68  10K  [RES-1206]
R70  10K  [RES-1206]
R71  10K  [RES-1206]
R72  10K  [RES-1206]
R73  10K  [RES-1206]
R74  10K  [RES-1206]
R75  10K  [RES-1206]
R76  10K  [RES-1206]
R77  10K  [RES-1206]
R78  10K  [RES-1206]
R79  10K  [RES-1206]
R80  10K  [RES-1206]
R81  10K  [RES-1206]
R82  10K  [RES-1206]
R83  10K  [RES-1206]
R84  10K  [RES-1206]
R85  10K  [RES-1206]
R86  10K  [RES-1206]
R87  10K  [RES-1206]
R88  10K  [RES-1206]
R89  10K  [RES-1206]
R90  10K  [RES-1206]
R91  10K  [RES-1206]
R92  10K  [RES-1206]
R93  10K  [RES-1206]
R94  10K  [RES-1206]
R95  10K  [RES-1206]
R96  10K  [RES-1206]
R97  10K  [RES-1206]
R98  10K  [RES-1206]
R99  10K  [RES-1206]
R100  10K  [RES-1206]
R101  10K  [RES-1206]
U18  BU4SU69G2  [SSOP5]

### Ports
Shutdown

### Nets
12V: C59.2 U18.5(VCC)
GND: C59.1 U18.3(GND)
HV+: R52.2 R53.2 R54.2 R55.2 R56.2 R57.2 R58.2 R59.2
HV-GND: Q22.3 R60.1
DIS-GATE: Q22.1 R60.2 U18.4(~{OUT})
Shutdown: U18.2(IN) ; port Shutdown
NetQ22_2: Q22.2 R94.1 R95.1 R96.1 R97.1 R98.1 R99.1 R100.1 R101.1
NetR52_1: R52.1 R61.2
NetR53_1: R53.1 R62.2
NetR54_1: R54.1 R63.2
NetR55_1: R55.1 R64.2
NetR56_1: R56.1 R65.2
NetR57_1: R57.1 R66.2
NetR58_1: R58.1 R67.2
NetR59_1: R59.1 R68.2
NetR61_1: R61.1 R70.2
NetR62_1: R62.1 R71.2
NetR63_1: R63.1 R72.2
NetR64_1: R64.1 R73.2
NetR65_1: R65.1 R74.2
NetR66_1: R66.1 R75.2
NetR67_1: R67.1 R76.2
NetR68_1: R68.1 R77.2
NetR70_1: R70.1 R78.2
NetR71_1: R71.1 R79.2
NetR72_1: R72.1 R80.2
NetR73_1: R73.1 R81.2
NetR74_1: R74.1 R82.2
NetR75_1: R75.1 R83.2
NetR76_1: R76.1 R84.2
NetR77_1: R77.1 R85.2
NetR78_1: R78.1 R86.2
NetR79_1: R79.1 R87.2
NetR80_1: R80.1 R88.2
NetR81_1: R81.1 R89.2
NetR82_1: R82.1 R90.2
NetR83_1: R83.1 R91.2
NetR84_1: R84.1 R92.2
NetR85_1: R85.1 R93.2
NetR86_1: R86.1 R94.2
NetR87_1: R87.1 R95.2
NetR88_1: R88.1 R96.2
NetR89_1: R89.1 R97.2
NetR90_1: R90.1 R98.2
NetR91_1: R91.1 R99.2
NetR92_1: R92.1 R100.2
NetR93_1: R93.1 R101.2

Not connected (* = marked no-connect by the designer): U18 1(NC)*

### Notes on the sheet
- Discharge System
- 10K 3/4W array
  Rtot = 1 / 8x1/60K
  = 7.5K 36W equivalent
- Title
- Size:
- Date:
- A4
- Number:
- Time:
- Revision:
- Sheet
- of
- File:

### Library data of the parts
C59 = 0805-1uF-50V: as C33 on sheet PhaseCLeg; Supplier 1: Digi-Key; Stock 1: 7193; Pricing 1: 1=0.33, 10=0.23, 100=0.1378, 500=0.10334, 1000=0.08726 (USD); Mount: Surface Mount; Case/Package: 0805; Weight: 0.000194oz; Case Code (Metric): 2012; Case Code (Imperial): 0805; Min Operating Temperature: -55°C; Max Operating Temperature: 85°C; Dielectric: X5R; Packaging: Tape and Reel; Termination: SMD/SMT; Voltage Rating (DC): 50V; Package Quantity: 2500; Length: 0.079inch; Width: 0.049inch; Thickness: 0.055inch; REACH SVHC: No SVHC; Lead Free: Lead Free; ComponentLink1URL: https://api.kemet.com/component-edge/download/datasheet/C0805C105K5PAC7800.pdf?src-supplier=Digi-Key; ComponentLink1Description: https://api.kemet.com/component-edge/download/datasheet/C0805C105K5PAC7800.pdf?src-supplier=Digi-Key; ComponentLink2URL: http://www.farnell.com/datasheets/2746140.pdf?src-supplier=Farnell; ComponentLink2Description: http://www.farnell.com/datasheets/2746140.pdf?src-supplier=Farnell; ComponentLink3URL: http://www.mouser.com/ds/2/212/KEM_C1006_X5R_SMD-1103249.pdf?src-supplier=Mouser; ComponentLink3Description: http://www.mouser.com/ds/2/212/KEM_C1006_X5R_SMD-1103249.pdf?src-supplier=Mouser; ComponentLink4URL: http://www.farnell.com/datasheets/2746140.pdf?src-supplier=Newark; ComponentLink4Description: http://www.farnell.com/datasheets/2746140.pdf?src-supplier=Newark; ComponentLink5URL: http://www.farnell.com/datasheets/2032728.pdf?src-supplier=Element14; ComponentLink5Description: http://www.farnell.com/datasheets/2032728.pdf?src-supplier=Element14; Supplier Part Number 1: 399-15436-6-ND; Capacitance: 1uF
Q22 = STL12N60M2: MOSFET N-CH 600V 6.5A POWERFLAT; Manufacturer: STMicroelectronics; Rds On Max: 495mR; Input Capacitance: 538pF; Max Power Dissipation: 52W; Supplier 1: Digi-Key; Manufacturer Part Number: STL12N60M2; Stock 1: 2323; Pricing 1: 1=1.67, 10=1.491, 25=1.4156, 100=1.1628, 500=0.96056, 1000=0.8043 (USD); Mount: Surface Mount; Number of Pins: 8; Min Operating Temperature: -55°C; Max Operating Temperature: 150°C; Packaging: Tape and Reel; Drain to Source Voltage (Vdss): 600V; Continuous Drain Current (ID): 6.5A; ComponentLink1URL: http://www.st.com/content/ccc/resource/technical/document/datasheet/65/14/17/85/17/67/44/ac/DM00187264.pdf/files/DM00187264.pdf/jcr:content/translations/en.DM00187264.pdf?src-supplier=Digi-Key; ComponentLink1Description: http://www.st.com/content/ccc/resource/technical/document/datasheet/65/14/17/85/17/67/44/ac/DM00187264.pdf/files/DM00187264.pdf/jcr:content/translations/en.DM00187264.pdf?src-supplier=Digi-Key; ComponentLink2URL: http://www.mouser.com/ds/2/389/stl12n60m2-956130.pdf?src-supplier=Mouser; ComponentLink2Description: http://www.mouser.com/ds/2/389/stl12n60m2-956130.pdf?src-supplier=Mouser; Supplier Part Number 1: 497-16039-6-ND
R52-R59 R61-R68 R70-R101 = 1206-10KR: RES SMD 10K OHM 1% 3/4W 1206; Manufacturer: Vishay Dale; Manufacturer Part Number: RCA120610K0FKEAHP; Resistance: 10kR; Max Power Dissipation: 750mW; Temperature Coefficient: 100ppm/°C; Supplier 1: Digi-Key; Stock 1: 6454; Pricing 1: 1=0.52, 10=0.369, 100=0.1919, 1000=0.10332, 2500=0.09963 (USD); Case/Package: 1206; Case Code (Imperial): 1206; Case Code (Metric): 3216; Min Operating Temperature: -55°C; Max Operating Temperature: 155°C; Resistor Type: Thick Film; Features: Automotive AEC-Q200,Anti-Sulfur; Packaging: Tape and Reel; Tolerance: 1%; Number of Terminations: 2; RoHS Compliant: Yes; ComponentLink1URL: http://www.vishay.com/docs/20067/rcahp.pdf?src-supplier=Digi-Key; ComponentLink1Description: http://www.vishay.com/docs/20067/rcahp.pdf?src-supplier=Digi-Key; Supplier Part Number 1: 541-3251-6-ND
R60 = 0603-10KR: as R40 on sheet Sensors; Supplier 1: Digi-Key; Stock 1: 3006558; Pricing 1: 1=0.1, 10=0.019, 100=0.0077, 1000=0.00347, 2500=0.00301 (USD); Case/Package: 0603; Number of Pins: 2; Contact Plating: Tin,Matte; Case Code (Imperial): 0603; Case Code (Metric): 1608; Min Operating Temperature: -55°C; Max Operating Temperature: 155°C; Packaging: Tape and Reel; Tolerance: 5%; Composition: Thick Film; Voltage Rating: 50V; Termination: SMD/SMT; Military Standard: Not; Features: Moisture Resistant; Max Power Dissipation: 100mW; Number of Terminations: 2; Length: 0.063inch; Width: 0.031inch; Depth: 0.8mm; Height - Seated (Max): 0.022inch; Radiation Hardening: No; REACH SVHC: Unknown; Lead Free: Lead Free; ComponentLink1URL: http://www.yageo.com/documents/recent/PYu-RC_Group_51_RoHS_L_10.pdf?src-supplier=Digi-Key; ComponentLink1Description: http://www.yageo.com/documents/recent/PYu-RC_Group_51_RoHS_L_10.pdf?src-supplier=Digi-Key; Supplier Part Number 1: 311-10KGRDKR-ND
U18 = BU4SU69G2: IC INVERTER 1CH 1-INP 5SSOP; Manufacturer: Rohm; Manufacturer Part Number: BU4SU69G2-TR; Number of Inputs: 1; Propagation Delay: 25ns; Max Supply Voltage: 16V; Min Supply Voltage: 3V; Quiescent Current: 1uA; High Level Output Current: 3.4mA; Supplier 1: Digi-Key; Stock 1: 2901; Pricing 1: 1=0.89, 10=0.781, 25=0.7336, 100=0.5986, 250=0.556, 500=0.47318, 1000=0.37855 (USD); Mount: Surface Mount; Case/Package: SSOP; Number of Pins: 5; Contact Plating: Copper,Tin; Min Operating Temperature: -40°C; Max Operating Temperature: 85°C; Logic Function: Inverter; Number of Elements: 1; Package Quantity: 1; Packaging: Tape and Reel; Number of Circuits: 1; Low Level Output Current: 3.4mA; Turn-On Delay Time: 25ns; Number of Gates: 1; Series: 4S; Number of Functions: 1; Supply Voltage-Nom: 16V; Technology: CMOS; Radiation Hardening: No; Lead Free: Lead Free; RoHS Compliant: Yes; ComponentLink1URL: http://www.mouser.com/ds/2/348/bu4su69g2-e-962457.pdf?src-supplier=Mouser; ComponentLink1Description: http://www.mouser.com/ds/2/348/bu4su69g2-e-962457.pdf?src-supplier=Mouser; ComponentLink2URL: http://rohmfs.rohm.com/en/products/databook/datasheet/ic/logic_switch/standard_logic/bu4s01g2-e.pdf?src-supplier=Avnet; ComponentLink2Description: http://rohmfs.rohm.com/en/products/databook/datasheet/ic/logic_switch/standard_logic/bu4s01g2-e.pdf?src-supplier=Avnet; ComponentLink3URL: https://www.verical.com/server-webapp/html/getDatasheet?partID=458866&src-supplier=Verical; ComponentLink3Description: https://www.verical.com/server-webapp/html/getDatasheet?partID=458866&src-supplier=Verical; ComponentLink4URL: http://rohmfs.rohm.com/en/techdata_basic/ic/package/ssop5_1-e.pdf?src-supplier=Digi-Key; ComponentLink4Description: http://rohmfs.rohm.com/en/techdata_basic/ic/package/ssop5_1-e.pdf?src-supplier=Digi-Key; ComponentLink5URL: http://rohmfs.rohm.com/en/products/databook/datasheet/ic/logic_switch/standard_logic/bu4su69g2-e.pdf?src-supplier=Digi-Key; ComponentLink5Description: http://rohmfs.rohm.com/en/products/databook/datasheet/ic/logic_switch/standard_logic/bu4su69g2-e.pdf?src-supplier=Digi-Key; ComponentLink6URL: https://produktinfo.conrad.com/datenblaetter/125000-149999/140507-da-01-en-IC_BU4SU69G2_TR_SSOP5.pdf?src-supplier=Conrad; ComponentLink6Description: https://produktinfo.conrad.com/datenblaetter/125000-149999/140507-da-01-en-IC_BU4SU69G2_TR_SSOP5.pdf?src-supplier=Conrad; Supplier Part Number 1: BU4SU69G2DKR-ND

## Sheet Connectors.SchDoc: Connectors
size A4; DrawnBy: Jarod Krane; Organization: Altium Limited; Address1: L3, 12a Rodborough Rd; Address2: Frenchs Forest; Address3: NSW; Address4: Australia 2086; Revision: 0; SheetNumber: 8; SheetTotal: 11
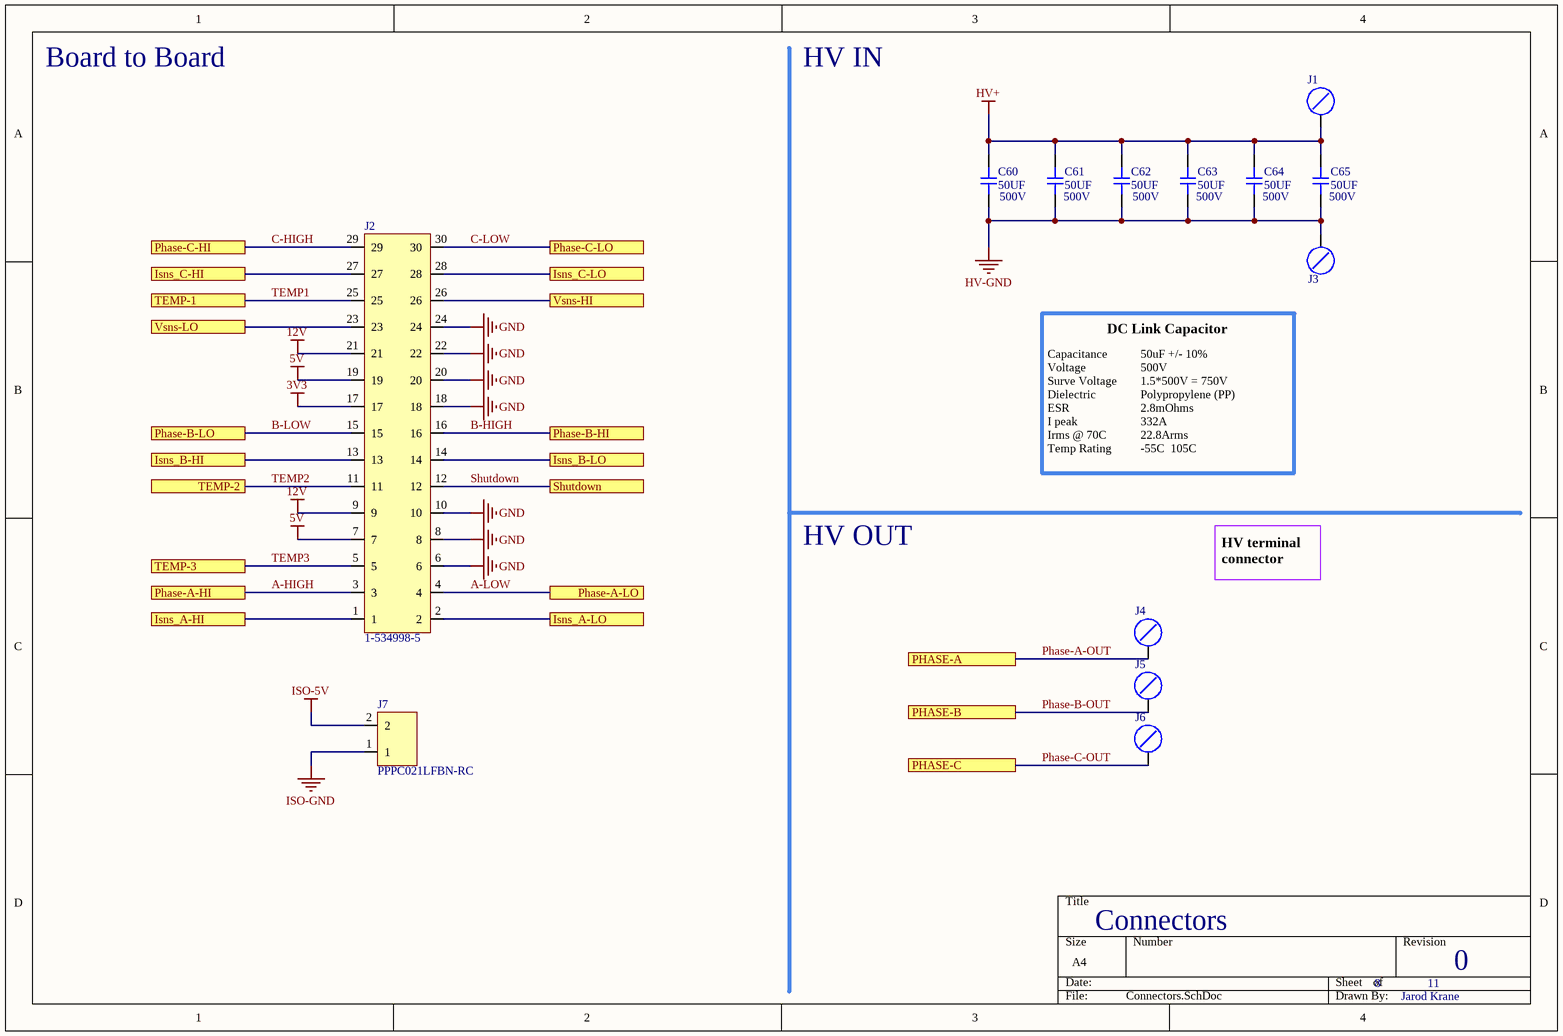
[diagram p9: Connectors.SchDoc]

### Parts
C60  50UF  Voltage Rating (DC): 500V  [DCLINKCAP]
C61  50UF  Voltage Rating (DC): 500V  [DCLINKCAP]
C62  50UF  Voltage Rating (DC): 500V  [DCLINKCAP]
C63  50UF  Voltage Rating (DC): 500V  [DCLINKCAP]
C64  50UF  Voltage Rating (DC): 500V  [DCLINKCAP]
C65  50UF  Voltage Rating (DC): 500V  [DCLINKCAP]
J1  M8 Terminal  [M8 Terminal]  (value not drawn)
J2  1-534998-5  [CONN POS-F]
J3  M8 Terminal  [M8 Terminal]  (value not drawn)
J4  M8 Terminal  [M8 Terminal]  (value not drawn)
J5  M8 Terminal  [M8 Terminal]  (value not drawn)
J6  M8 Terminal  [M8 Terminal]  (value not drawn)
J7  PPPC021LFBN-RC  [CONN-2POS-F]

### Ports
Isns_A-HI, Isns_A-LO, Isns_B-HI, Isns_B-LO, Isns_C-HI, Isns_C-LO, PHASE-A, Phase-A-HI, Phase-A-LO, PHASE-B, Phase-B-HI, Phase-B-LO, PHASE-C, Phase-C-HI, Phase-C-LO, Shutdown, TEMP-1, TEMP-2, TEMP-3, Vsns-HI, Vsns-LO

### Nets
3V3: J2.17
5V: J2.7 J2.19
12V: J2.9 J2.21
GND: J2.6 J2.8 J2.10 J2.18 J2.20 J2.22 J2.24
HV+: C60.2 C61.2 C62.2 C63.2 C64.2 C65.2 J1.1
HV-GND: C60.1 C61.1 C62.1 C63.1 C64.1 C65.1 J3.1
ISO-5V: J7.2
ISO-GND: J7.1
A-HIGH: J2.3 ; port Phase-A-HI
A-LOW: J2.4 ; port Phase-A-LO
B-HIGH: J2.16 ; port Phase-B-HI
B-LOW: J2.15 ; port Phase-B-LO
C-HIGH: J2.29 ; port Phase-C-HI
C-LOW: J2.30 ; port Phase-C-LO
IsnsA_N: J2.2 ; port Isns_A-LO
IsnsA_P: J2.1 ; port Isns_A-HI
IsnsB_N: J2.14 ; port Isns_B-LO
IsnsB_P: J2.13 ; port Isns_B-HI
IsnsC_N: J2.28 ; port Isns_C-LO
IsnsC_P: J2.27 ; port Isns_C-HI
Phase-A-OUT: J4.1 ; port PHASE-A
Phase-B-OUT: J5.1 ; port PHASE-B
Phase-C-OUT: J6.1 ; port PHASE-C
Shutdown: J2.12 ; port Shutdown
TEMP1: J2.25 ; port TEMP-1
TEMP2: J2.11 ; port TEMP-2
TEMP3: J2.5 ; port TEMP-3
Vsns_N: J2.23 ; port Vsns-LO
Vsns_P: J2.26 ; port Vsns-HI

### Notes on the sheet
- Board to Board
- HV IN
- DC Link Capacitor
- Capacitance
  Voltage
  Surve Voltage
  Dielectric
  ESR
  I peak
  Irms @ 70C
  Temp Rating
- 50uF +/- 10%
  500V
  1.5*500V = 750V
  Polypropylene (PP)
  2.8mOhms
  332A
  22.8Arms
  -55C  105C
- HV OUT
- HV terminal connector
- Title
- Size:
- Date:
- B
- Number:
- Time:
- Revision:
- Sheet
- of
- File:

### Library data of the parts
C60-C65 = 50UF-500V: CAP FILM 50UF 10% 500VDC RADIAL; Manufacturer: KEMET; Manufacturer Part Number: C4AQLBW5500A3JK; Dielectric Material: PP; ESR (Equivalent Series Resistance): 2.8mR; Supplier 1: Digi-Key; Stock 1: 0; Mount: Through Hole; Case/Package: Radial; Min Operating Temperature: -40°C; Max Operating Temperature: 105°C; Packaging: Bulk; Capacitance: 50uF; Tolerance: 10%; Termination: PC Pins; Ratings: AEC-Q200; RoHS Compliant: Yes; ComponentLink1URL: http://www.farnell.com/datasheets/2754776.pdf?src-supplier=Farnell; ComponentLink1Description: http://www.farnell.com/datasheets/2754776.pdf?src-supplier=Farnell; ComponentLink2URL: http://www.farnell.com/datasheets/2754776.pdf?src-supplier=Element14; ComponentLink2Description: http://www.farnell.com/datasheets/2754776.pdf?src-supplier=Element14; ComponentLink3URL: https://media.digikey.com/pdf/Data%20Sheets/Kemet%20PDFs/C4AQ%20Series,%20Auto.pdf?src-supplier=Digi-Key; ComponentLink3Description: https://media.digikey.com/pdf/Data%20Sheets/Kemet%20PDFs/C4AQ%20Series,%20Auto.pdf?src-supplier=Digi-Key; ComponentLink4URL: http://www.farnell.com/datasheets/2754776.pdf?src-supplier=Newark; ComponentLink4Description: http://www.farnell.com/datasheets/2754776.pdf?src-supplier=Newark; Supplier Part Number 1: 399-17001-ND
J1 J3-J6 = M8 Terminal: M8 Screw terminal for HV connections
J2 = CONN-30POS-F: 30 Position Receptacle Connector 0.100" (2.54mm) Through Hole Gold; Manufacturer: TE Connectivity; Number of Positions: 30; Connector Type: Receptacle,Connector,Socket; PCB Mount Retention: Without; PCB Mounting Orientation: Vertical; Contact Current Rating: 2A; Insulation Resistance: 5GR; Contact Resistance: 12MR; Gender: Female; Boss: No (Without); High Temperature Compatible: No; Stackable: Yes; Voltage Rating: 250V; Row Spacing: 0.1inch; PCB Thickness: 1.57mm; Contact Post Length: 0.125inch; Plating Thickness: 7.61um; Tail Length: 3.18mm; Approvals: CSA; Supplier 1: Digi-Key; Manufacturer Part Number: 1-534998-5; Stock 1: 870; Pricing 1: 1=4.73, 10=4.536, 100=3.78, 500=3.213, 1000=2.7405, 5000=2.457 (USD); Mount: Through Hole; Contact Plating: Gold,Tin,Lead; Color: Black; Contact Material: Bronze; Housing Color: Black; Housing Material: Thermoplastic; Contact Shape: Round; Min Operating Temperature: -65°C; Max Operating Temperature: 125°C; Number of Rows: 2; Package Quantity: 15; Packaging: Rail/Tube; Termination: Solder; Number of Contacts: 30; Series: AMPMODU MOD IV; Contact Type: Female Socket; Orientation: Straight; Current Rating: 2A; Sealable: No (Without); Length: 38.1mm; Height: 5.03mm; Pitch: 2.54mm; Contact Mating Length: 3.77mm; Depth: 5.03mm; Radiation Hardening: No; Lead Free: Contains Lead; ELV: Non-Compliant; Flammability Rating: UL94 V-0; ComponentLink1URL: http://www.te.com/commerce/DocumentDelivery/DDEController?Action=srchrtrv&DocNm=1307819_AMPMODU&DocType=DS&DocLang=English&s_cid=1046&src-supplier=Avnet; ComponentLink1Description: http://www.te.com/commerce/DocumentDelivery/DDEController?Action=srchrtrv&DocNm=1307819_AMPMODU&DocType=DS&DocLang=English&s_cid=1046&src-supplier=Avnet; ComponentLink2URL: http://www.onlinecomponents.com/productFiles/mf-AMP/eng_cat_1307819_0306_084_222_.pdf?src-supplier=Onlinecomponents.com; ComponentLink2Description: http://www.onlinecomponents.com/productFiles/mf-AMP/eng_cat_1307819_0306_084_222_.pdf?src-supplier=Onlinecomponents.com; ComponentLink3URL: https://www.te.com/commerce/DocumentDelivery/DDEController?Action=srchrtrv&DocNm=534998&DocType=Customer+Drawing&DocLang=English&src-supplier=Digi-Key; ComponentLink3Description: https://www.te.com/commerce/DocumentDelivery/DDEController?Action=srchrtrv&DocNm=534998&DocType=Customer+Drawing&DocLang=English&src-supplier=Digi-Key; Supplier Part Number 1: A26494-ND
J7 = CONN-2POS-F: CONN HDR 2POS 0.1 GOLD PCB; Manufacturer: Sullins; Number of Positions: 2; Connector Type: Header; Pitch: 0.1inch; Supplier 1: Digi-Key; Manufacturer Part Number: PPPC021LFBN-RC; Stock 1: 17824; Pricing 1: 1=0.33, 10=0.315, 100=0.2205, 500=0.189, 1000=0.1575, 5000=0.135, 10000=0.126 (USD); Mount: Through Hole; Color: Black; Contact Plating: Gold; Contact Material: Bronze; Housing Material: Plastic; Package Quantity: 1000; Number of Rows: 1; Packaging: Bulk; Termination: Solder; Contact Type: Female Socket; Length: 5.58mm; Width: 2.5mm; Height: 8.5mm; Lead Free: Lead Free; RoHS Compliant: Yes; Supplier Part Number 1: S7035-ND